# Altium schematic sheet DigitalLabBoard_Die.SchDoc
size A4
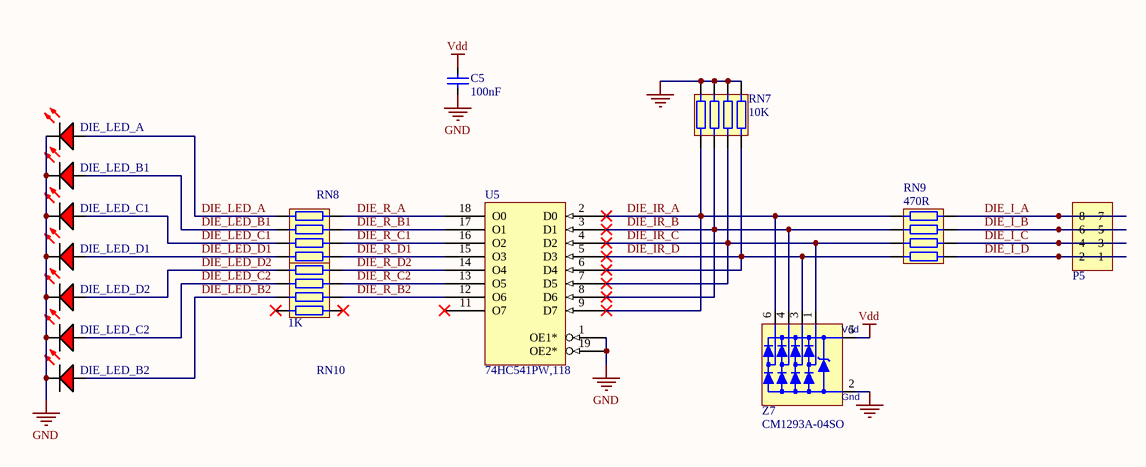
[diagram p0: DigitalLabBoard_Die.SchDoc]

## Parts
C5  100nF  [CCNP1608-0603]
DIE_LED_A  LED Red  [LED1608-0603-RED]  (value not drawn)
DIE_LED_B1  LED Red  [LED1608-0603-RED]  (value not drawn)
DIE_LED_B2  LED Red  [LED1608-0603-RED]  (value not drawn)
DIE_LED_C1  LED Red  [LED1608-0603-RED]  (value not drawn)
DIE_LED_C2  LED Red  [LED1608-0603-RED]  (value not drawn)
DIE_LED_D1  LED Red  [LED1608-0603-RED]  (value not drawn)
DIE_LED_D2  LED Red  [LED1608-0603-RED]  (value not drawn)
P5  Header 2x4  [HDR2X4S]  (value not drawn)
RN7  10K  [CR1206-0603_X4_N]
RN8  1K  [CR1206-0603_X4_N]
RN9  470R  [CR1206-0603_X4_N]
RN10  1K  [CR1206-0603_X4_N]
U5  74HC541PW,118  [TSSOP20_N]
Z7  CM1293A-04SO  [SOT457_N]

## Nets
GND: C5.1 DIE_LED_A.K DIE_LED_B1.K DIE_LED_B2.K DIE_LED_C1.K DIE_LED_C2.K DIE_LED_D1.K DIE_LED_D2.K RN7.1 RN7.2 RN7.3 RN7.4 U5.1(OE1*) U5.10(Gnd) U5.19(OE2*) Z7.2(Vn)
Vcc: U5.20(Vdd)
Vdd: C5.2 Z7.5(Vp)
DIE_I_A: P5.7 P5.8 RN9.8
DIE_I_B: P5.5 P5.6 RN9.7
DIE_I_C: P5.3 P5.4 RN9.6
DIE_I_D: P5.1 P5.2 RN9.5
DIE_IR_A: RN7.8 RN9.1 U5.2(D0) U5.9(D7) Z7.6
DIE_IR_B: RN7.7 RN9.2 U5.3(D1) U5.8(D6) Z7.4
DIE_IR_C: RN7.6 RN9.3 U5.4(D2) U5.7(D5) Z7.1
DIE_IR_D: RN7.5 RN9.4 U5.5(D3) U5.6(D4) Z7.3
DIE_LED_A: DIE_LED_A.A RN8.8
DIE_LED_B1: DIE_LED_B1.A RN8.7
DIE_LED_B2: DIE_LED_B2.A RN10.6
DIE_LED_C1: DIE_LED_C1.A RN8.6
DIE_LED_C2: DIE_LED_C2.A RN10.7
DIE_LED_D1: DIE_LED_D1.A RN8.5
DIE_LED_D2: DIE_LED_D2.A RN10.8
DIE_R_A: RN8.1 U5.18(O0)
DIE_R_B1: RN8.2 U5.17(O1)
DIE_R_B2: RN10.3 U5.12(O6)
DIE_R_C1: RN8.3 U5.16(O2)
DIE_R_C2: RN10.2 U5.13(O5)
DIE_R_D1: RN8.4 U5.15(O3)
DIE_R_D2: RN10.1 U5.14(O4)

Not connected (* = marked no-connect by the designer): RN10 4* 5*; U5 11(O7)*

## Notes on the sheet
- (in symbol CM1293A-04SO) Vdd; Gnd

## Library data of the parts
C5 = Cap_CCNP_0603: Capacitor non-polar SMT 0603; Manufacturer: Generic Components; Class: Passive; Published: 08/06/2000; Publisher: Altium Hobart Technology Centre; SubClass: Capacitor; Farnell PN: *; Digikey: *; Value: 100nF; LCSC: C14663
DIE_LED_A DIE_LED_B1 DIE_LED_B2 DIE_LED_C1 DIE_LED_C2 DIE_LED_D1 DIE_LED_D2 = LED-0603-Red: LED 0603 Red; Manufacturer: Generic Components; Class I: Optoelectronic; Published: 8-Jun-2000; Revision: July-2002: Re-released for DXP Platform.; Publisher: Altium Limited; Class II: LED; Farnell PN: 1581239; Digikey: *; LCSC: C2286
RN7 RN8 RN10 = ResistorNetwork_CR0603x4: SMT x4 Resistor Array; Farnell PN: *; Digikey: *
  RN7: Value: 10K; LCSC: C29718
  RN8 RN10: Value: 1K; LCSC: C20197
RN9 = ResistorNetwork_CR0603x4: SMT x4 Resistor Array; Value: 470 ohm; Farnell PN: *; Digikey: *; LCSC: C25510
U5 = 74HC541PW,118: Octal 3-State Buffer/Line Driver/LineReceiver; Digikey: 1727-5960-1-ND; Farnell PN: 2444902; LCSC: C5657
Z7 = CM1293A-04SO: Ultra low capacitance quadruple rail-to-rail ESD protection; Farnell PN: 2533258; Digikey: CM1293A-04SOOSCT-ND; LCSC: C393377
P5 = Header 2x4: Digikey: 609-5701-ND